# EAGLE design MainControl (EAGLE 9.6.2)
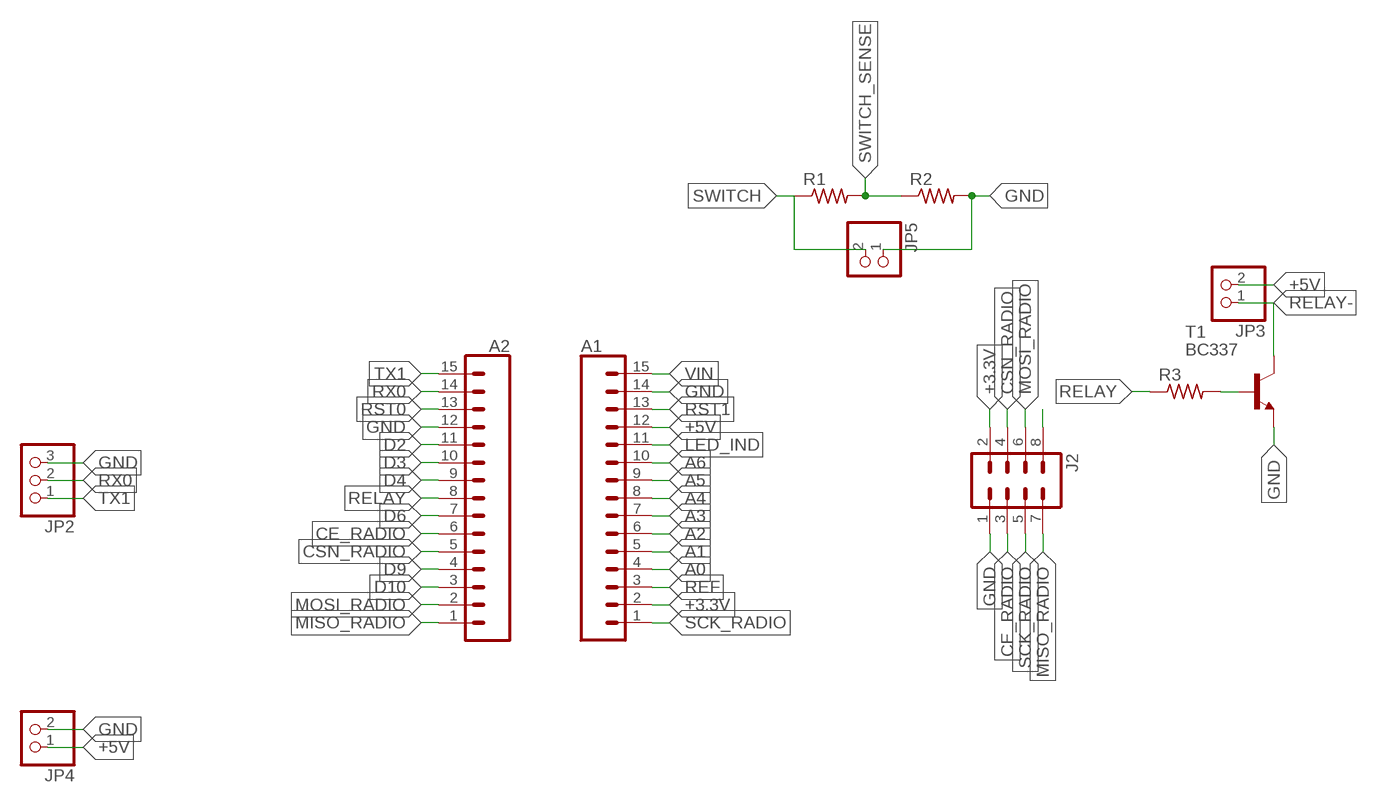
[diagram p0: schematic, sheet 1]

## Parts
A1  CONN_15  [1X15]
A2  CONN_15  [1X15]
J2  MA04-2  [MA04-2]
JP2  PINHD-1X3  [1X03]
JP3  PINHD-1X2  [1X02]
JP4  PINHD-1X2  [1X02]
JP5  PINHD-1X2  [1X02]
R1  R-US_0204/7  [0204/7]
R2  R-US_0204/7  [0204/7]
R3  R-US_0204/7  [0204/7]
T1  BC337  [TO92]

## Nets
+3.3V: A1.2 J2.2
+5V: A1.12 JP3.2 JP4.1
A0: A1.4
A1: A1.5
A2: A1.6
A3: A1.7
A4: A1.8
A5: A1.9
A6: A1.10
CE_RADIO: A2.6 J2.3
CSN_RADIO: A2.5 J2.4
D2: A2.11
D3: A2.10
D4: A2.9
D6: A2.7
D9: A2.4
D10: A2.3
GND: A1.14 A2.12 J2.1 JP2.3 JP4.2 JP5.1 R2.2 T1.1(E)
LED_IND: A1.11
MISO_RADIO: A2.1 J2.7
MOSI_RADIO: A2.2 J2.6
N$1: R3.2 T1.2(B)
N$6: J2.8
REF: A1.3
RELAY: A2.8 R3.1
RELAY-: JP3.1 T1.3(C)
RST0: A2.13
RST1: A1.13
RX0: A2.14 JP2.2
SCK_RADIO: A1.1 J2.5
SWITCH: JP5.2 R1.1
SWITCH_SENSE: R1.2 R2.1
TX1: A2.15 JP2.1
VIN: A1.15

## Library data of the parts
A1 = SparkFun-Connectors:CONN_15: Multi connection point. Often used as Generic Header-pin footprint for 0.1 inch spaced/style header connections On any of the 0.1 inch spaced packages, you can populate with these: Break Away Headers - Straight <https://www.sparkfun.com/products/116> (PRT-00116) Break Away Male Headers - Right Angle <https://www.sparkfun.com/products/553> (PRT-00553) Female Headers <https://www.sparkfun.com/products/115> (PRT-00115) Break Away Headers - Machine Pin <https://www.sparkfun.com/products/117> (PRT-00117) Break Away Female Headers - Swiss Machine Pin <https://www.sparkfun.com/products/743> (PRT-00743) For SCREWTERMINALS and SPRING TERMINALS visit here: Screw Terimnals on SparkFun.com <https://www.sparkfun.com/search/results?term=Screw+Terminals> (5mm/3.5mm/2.54mm spacing) This device is also useful as a general connection point to wire up your design to another part of your project. Our various solder wires solder well into these plated through hole pads. Hook-Up Wire - Assortment (Stranded, 22 AWG) <https://www.sparkfun.com/products/11375> (PRT-11375) Hook-Up Wire - Assortment (Solid Core, 22 AWG) <https://www.sparkfun.com/products/11367> (PRT-11367) View the entire wire category on our website here <https://www.sparkfun.com/categories/141> Special notes: Molex polarized connector foot print use with SKU : PRT-08231 with associated crimp pins and housings. 1MM SMD Version SKU: PRT-10208 NOTES ON THE VARIANTS LOCK and LOCK_LONGPADS... This footprint was designed to help hold the alignment of a through-hole component (i.e. 6-pin header) while soldering it into place. You may notice that each hole has been shifted either up or down by 0.005 of an inch from it's more standard position (which is a perfectly straight line). This slight alteration caused the pins (the squares in the middle) to touch the edges of the holes. Because they are alternating, it causes a "brace" to hold the component in place. 0.005 has proven to be the perfect amount of "off-center" position when using our standard breakaway headers. Although looks a little odd when you look at the bare footprint, once you have a header in there, the alteration is very hard to notice. Also,if you push a header all the way into place, it is covered up entirely on the bottom side.; SPICEPREFIX: X
A2 = SparkFun-Connectors:CONN_15: Multi connection point. Often used as Generic Header-pin footprint for 0.1 inch spaced/style header connections On any of the 0.1 inch spaced packages, you can populate with these: Break Away Headers - Straight <https://www.sparkfun.com/products/116> (PRT-00116) Break Away Male Headers - Right Angle <https://www.sparkfun.com/products/553> (PRT-00553) Female Headers <https://www.sparkfun.com/products/115> (PRT-00115) Break Away Headers - Machine Pin <https://www.sparkfun.com/products/117> (PRT-00117) Break Away Female Headers - Swiss Machine Pin <https://www.sparkfun.com/products/743> (PRT-00743) For SCREWTERMINALS and SPRING TERMINALS visit here: Screw Terimnals on SparkFun.com <https://www.sparkfun.com/search/results?term=Screw+Terminals> (5mm/3.5mm/2.54mm spacing) This device is also useful as a general connection point to wire up your design to another part of your project. Our various solder wires solder well into these plated through hole pads. Hook-Up Wire - Assortment (Stranded, 22 AWG) <https://www.sparkfun.com/products/11375> (PRT-11375) Hook-Up Wire - Assortment (Solid Core, 22 AWG) <https://www.sparkfun.com/products/11367> (PRT-11367) View the entire wire category on our website here <https://www.sparkfun.com/categories/141> Special notes: Molex polarized connector foot print use with SKU : PRT-08231 with associated crimp pins and housings. 1MM SMD Version SKU: PRT-10208 NOTES ON THE VARIANTS LOCK and LOCK_LONGPADS... This footprint was designed to help hold the alignment of a through-hole component (i.e. 6-pin header) while soldering it into place. You may notice that each hole has been shifted either up or down by 0.005 of an inch from it's more standard position (which is a perfectly straight line). This slight alteration caused the pins (the squares in the middle) to touch the edges of the holes. Because they are alternating, it causes a "brace" to hold the component in place. 0.005 has proven to be the perfect amount of "off-center" position when using our standard breakaway headers. Although looks a little odd when you look at the bare footprint, once you have a header in there, the alteration is very hard to notice. Also,if you push a header all the way into place, it is covered up entirely on the bottom side.
J2 = con-lstb:MA04-2: PIN HEADER; OC_FARNELL: unknown; OC_NEWARK: unknown
JP2 = pinhead:PINHD-1X3: PIN HEADER
JP3-JP5 = pinhead:PINHD-1X2: PIN HEADER
R1-R3 = adafruit:R-US_: RESISTOR, American symbol
T1 = transistor:BC337: NPN TRANSISTOR

## Board
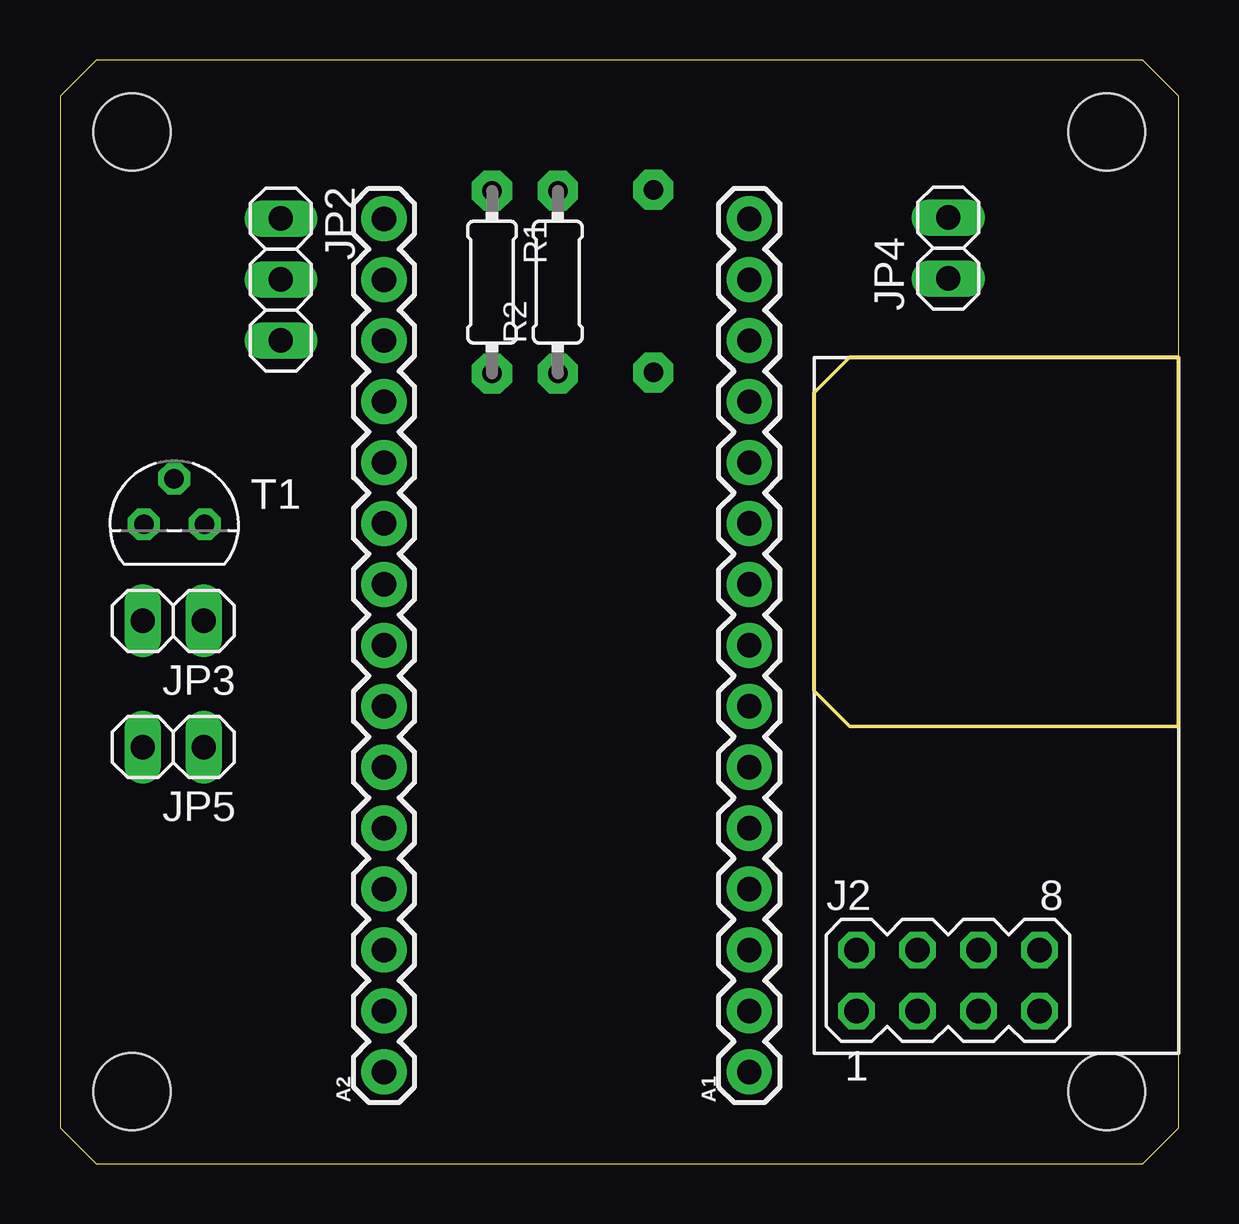
[diagram p1: board, top side]
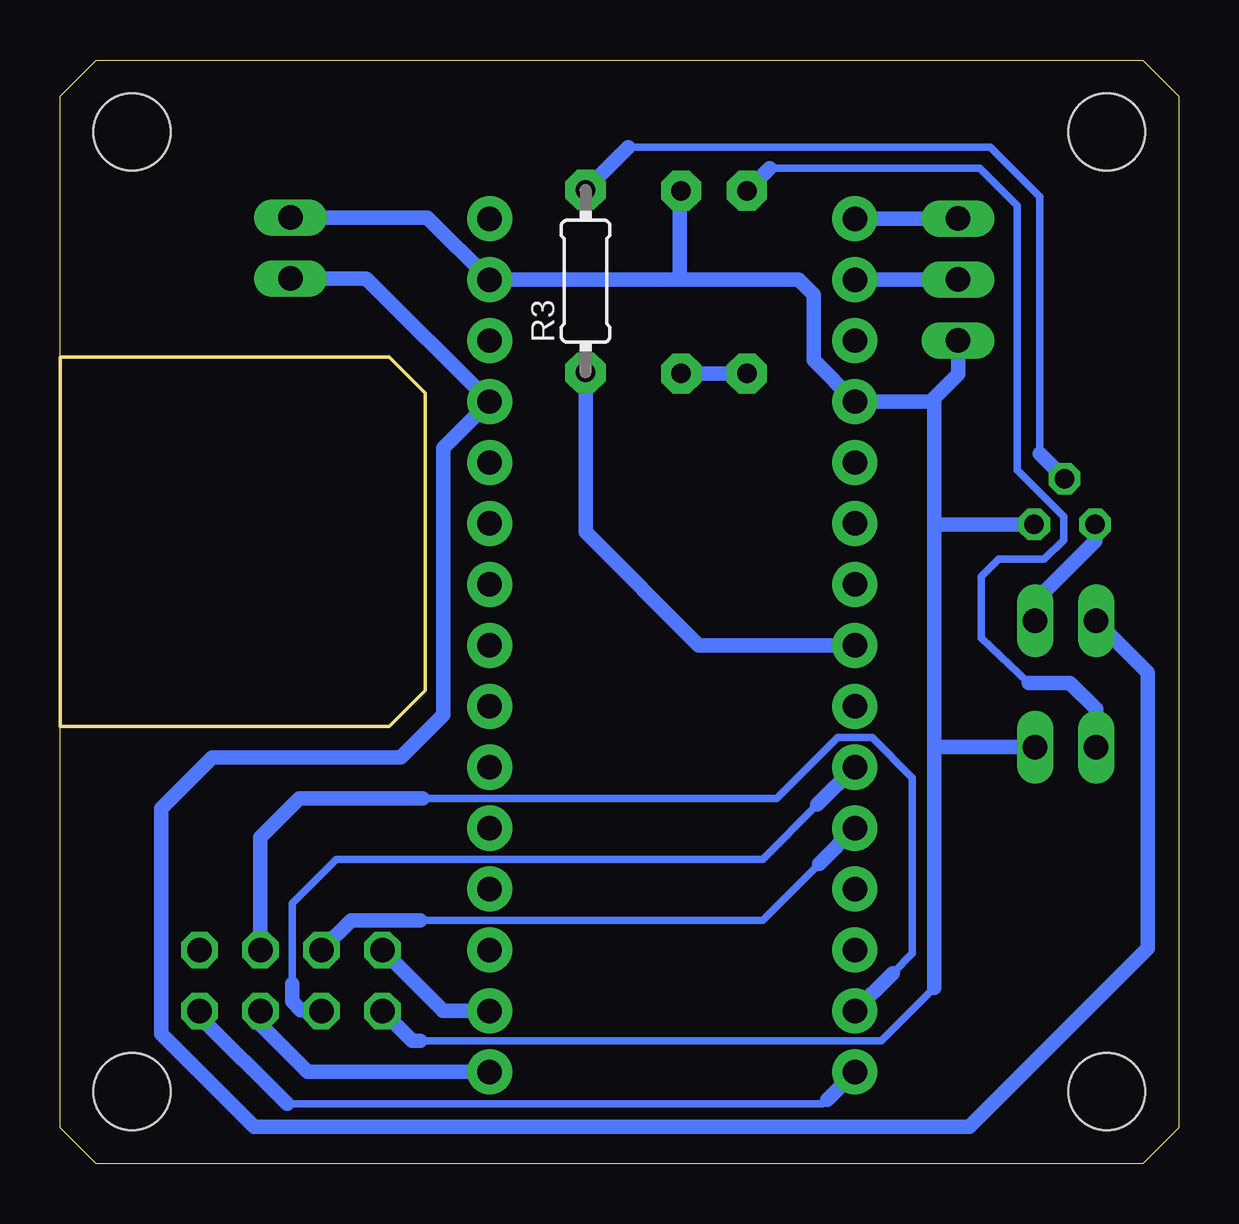
[diagram p2: board, bottom side, seen from below]

Size 46.62 x 46 mm. Coordinates in mm from the lower left corner, seen from the top.
Outline: 1.5,0 45.12,0 46.62,1.5 46.62,44.5 45.12,46 1.5,46 0,44.5 0,1.5 1.5,0
Outline: 32.9,18.22 46.6,18.22 46.6,33.62 32.9,33.62 31.4,32.12 31.4,19.72 32.9,18.22
Copper layers (1*16): Top 0.035mm / dielectric 1.5mm / Bottom 0.035mm
Design rules "default *": minimum track width 6mil, minimum drill 0.35mm, track to track 6mil, track to pad 6mil, pad to pad 6mil, via to via 6mil, smd to smd 6mil, copper to edge 10mil, drill to drill 6mil, minimum pad ring 10mil, minimum via ring 8mil, stop-mask expansion 4mil, vias tented up to drill 0mil, thermal gap 10mil
Holes 3.2 mm at 3,3 43.62,43 3,43 43.62,3

### Footprints (pad centres in the part's own frame; a part is rotated, then mirrored left to right if it is on the bottom)
1X15 = drill 1.016 pad 1.88: 1 0,0; 2 2.54,0; 3 5.08,0; 4 7.62,0; 5 10.16,0; 6 12.7,0; 7 15.24,0; 8 17.78,0; 9 20.32,0; 10 22.86,0; 11 25.4,0; 12 27.94,0; 13 30.48,0; 14 33.02,0; 15 35.56,0
MA04-2 = drill 1.016 octagon: 1 -3.81,-1.27; 2 -3.81,1.27; 3 -1.27,-1.27; 4 -1.27,1.27; 5 1.27,-1.27; 6 1.27,1.27; 7 3.81,-1.27; 8 3.81,1.27
1X03 = drill 1.016 long: 1 -2.54,0; 2 0,0; 3 2.54,0
1X02 = drill 1.016 long: 1 -1.27,0; 2 1.27,0
0204/7 = drill 0.813 pad 1.676 octagon: 1 -3.81,0; 2 3.81,0
TO92 = drill 0.813 octagon: 1 1.27,0; 2 0,1.905; 3 -1.27,0

### Placement (x,y rotation side)
A1  28.72,3.82 90 top
A2  13.5,3.82 90 top
J2  37,7.63 0 top
JP2  9.2,36.85 270 top
JP3  4.72,22.62 180 top
JP4  37.01,38.16 90 top
JP5  4.72,17.36 180 top
R1  18,36.74 270 top
R2  20.74,36.74 90 top
R3  24.72,36.78 90 bottom
T1  4.76,26.64 0 top

### Tracks (layer width: path | path; a pad name or v marks a point on that pad's centre or on a via)
+3.3V
  Bottom 0.305: 30.66,6.36 30.7,6.41 30.8,6.5
  Bottom 0.61: J2.2 30.8,6.5 | 30.66,6.36 A1.2
+5V
  Bottom 0.61: JP3.2 1.29,20.46 1.29,8.97 8.73,1.53 38.53,1.53 42.4,5.4 42.4,14.8 40.27,16.93 32.43,16.93 30.66,18.7 30.66,29.83 A1.12 33.85,36.89 JP4.1
CE_RADIO
  Bottom 0.305: 15.06,14.96 17.34,12.69 35.1,12.69 36.95,10.84 36.95,7.5 | 36.95,6.76 36.95,6.8 | 36.4,6.38 36.58,6.39
  Bottom 0.61: J2.3 35.76,6.38 36.4,6.38 | 36.58,6.39 36.95,6.76 | 36.95,6.8 36.95,7.5 | A2.6 15.06,14.96
CSN_RADIO
  Bottom 0.305: 31.6,10.14 17.34,10.14 14.99,12.49
  Bottom 0.61: J2.4 34.48,10.14 31.6,10.14 | A2.5 14.99,12.49
GND
  Bottom 0.305: 12.98,5.12 | 12.98,5.12 12.4,5.12 10.2,7.32 | A2.12 13.43,31.69 | 31.6,5.12 12.98,5.12 | 10.04,17.36 10.2,17.2
  Bottom 0.61: 20.8,36.84 15.84,36.84 15.22,36.22 15.22,33.48 A2.12 10.34,31.76 10.2,31.9 | 20.8,36.84 A1.14 31.31,39.43 JP4.2 | JP2.3 9.2,32.9 10.2,31.9 | 10.2,31.9 10.2,26.6 | 10.2,26.6 10.2,17.2 10.2,7.32 | J2.1 31.95,5.12 31.6,5.12 | JP5.1 10.04,17.36 | T1.1 10.16,26.64 10.2,26.6 | R2.2 20.8,40.49 20.8,36.84
MISO_RADIO
  Bottom 0.305: 14.66,2.66 14.83,2.49 37.16,2.49 | 37.16,2.49
  Bottom 0.61: J2.7 40.81,6.14 37.16,2.49 | A2.1 14.66,2.66
MOSI_RADIO
  Bottom 0.305: 31.5,15.22 16.76,15.22 14.22,17.77 12.78,17.77 11.1,16.08 11.1,8.76 11.93,7.93
  Bottom 0.61: J2.6 38.27,13.6 36.65,15.22 31.5,15.22 | A2.2 11.93,7.93
N$1
  Bottom 0.305: 22.94,42.37 7.87,42.37 5.8,40.3 5.8,29.59
  Bottom 0.61: T1.2 5.8,29.59 | R3.2 22.94,42.37
RELAY
  Bottom 0.61: A2.8 20,21.6 24.72,26.32 R3.1
RELAY-
  Bottom 0.61: T1.3 3.49,25.94 5.99,23.44 JP3.1
RX0
  Bottom 0.305: A2.14
  Bottom 0.61: JP2.2 A2.14
SCK_RADIO
  Bottom 0.61: J2.5 38.27,5.79 36.3,3.82 | A1.1 36.3,3.82 | 36.3,3.82
SWITCH
  Bottom 0.305: 18,41.11 R1.1 | 6.26,20.04 8.22,21.9 8.22,24.48 7.5,25.2 5.6,25.2 4.8,26 4.8,26.98 6.72,28.9 6.72,39.92 8.3,41.5 17.05,41.5
  Bottom 0.61: JP5.2 3.45,18.95 4.54,20.04 6.26,20.04 | R1.1 17.05,41.5
SWITCH_SENSE
  Bottom 0.61: R1.2 R2.1
TX1
  Bottom 0.61: JP2.1 A2.15